# Altium schematic sheet IR Receiver.SchDoc
size A4; SheetNumber: 6; SheetTotal: 7
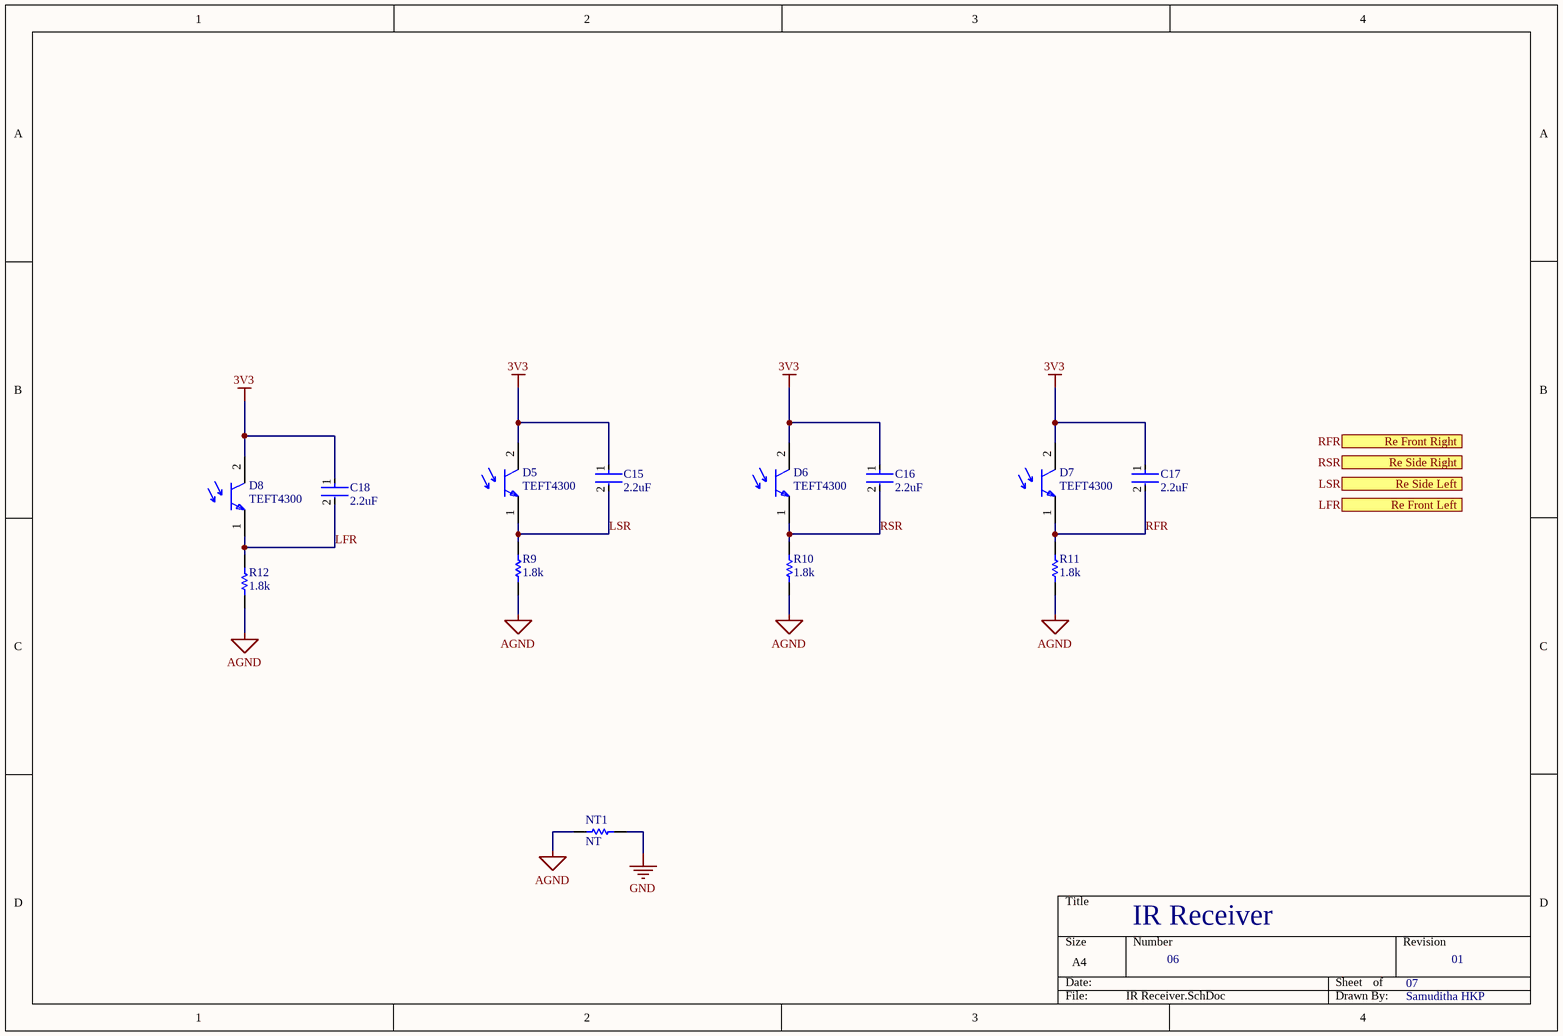
[diagram p0: IR Receiver.SchDoc]

## Parts
C15  2.2uF  [FP-C0402C225M9PACTU-MFG]
C16  2.2uF  [FP-C0402C225M9PACTU-MFG]
C17  2.2uF  [FP-C0402C225M9PACTU-MFG]
C18  2.2uF  [FP-C0402C225M9PACTU-MFG]
D5  TEFT4300  [FP-6_544-5269_01-4-MFG]
D6  TEFT4300  [FP-6_544-5269_01-4-MFG]
D7  TEFT4300  [FP-6_544-5269_01-4-MFG]
D8  TEFT4300  [FP-6_544-5269_01-4-MFG]
NT1  NT  [RESC1005X40X25LL05T05]
R9  1.8k  [RESC1005X40X25LL05T05]
R10  1.8k  [RESC1005X40X25LL05T05]
R11  1.8k  [RESC1005X40X25LL05T05]
R12  1.8k  [RESC1005X40X25LL05T05]

## Ports
Re Front Left (out, see Main[1B], MCU[1B]), Re Front Right (out, see Main[1B], MCU[1B]), Re Side Left (out, see Main[1B], MCU[1B]), Re Side Right (out, see Main[1B], MCU[1B])

## Nets
3V3: C15.1 C16.1 C17.1 C18.1 D5.2(C) D6.2(C) D7.2(C) D8.2(C)
AGND: NT1.2 R9.1 R10.1 R11.1 R12.1
GND: NT1.1
LFR: C18.2 D8.1(E) R12.2 ; port Re Front Left
LSR: C15.2 D5.1(E) R9.2 ; port Re Side Left
RFR: C17.2 D7.1(E) R11.2 ; port Re Front Right
RSR: C16.2 D6.1(E) R10.2 ; port Re Side Right

## Notes on the sheet
- IR Receiver
- 06
- 07
- 01
- Samuditha HKP

## Library data of the parts
C15-C18 = CMP-2008-02064-3: CAP CER 2.2UF 6.3V X5R 0402; Tolerance: 20%; Dissipation Factor: 5%; Dielectric Material: Ceramic; Lead Free: Lead Free; Depth: 0.5mm; Series: C; Termination: SMD/SMT; Case Code (Metric): 1005; Case/Package: 0402; Dielectric: X5R; RoHS Compliant: Yes; Thickness: 0.022inch; Voltage Rating: 6.3V; Voltage: 6.3V; Height: 0.5mm; Mount: Surface Mount; Construction: Flat; Case Code (Imperial): 0402; Min Operating Temperature: -55°C; Contact Plating: Tin; Radiation Hardening: No; Number of Pins: 2; Voltage Rating (DC): 6.3V; Capacitance: 2.2uF; Width: 0.5mm; Package Quantity: 1; Packaging: Tape and Reel; Max Operating Temperature: 85°C; Length: 1mm; REACH SVHC: No SVHC
D5-D8 = CMP-00030-39729854-1: TEFT4300 PHOTOTRANSISTOR 3.0MM WIDE VIEW / Phototransistor IR Chip Silicon 925nm 2-Pin T-1; Polarity: NPN; Lens Style: Domed; Max Power Dissipation: 100mW; Viewing Angle: 30°; Collector Emitter Breakdown Voltage: 70V; Number of Elements: 1; Rise Time: 2µs; Dark Current: 200nA; Collector Emitter Saturation Voltage: 300mV; Fall Time: 2.3µs; Max Collector Current: 50mA; Max Operating Temperature: 100°C; Schedule B: 8541407080, 8541407080; Min Operating Temperature: -40°C; Orientation: Top View; Height: 4.5mm; Radiation Hardening: No; Power Consumption: 100mW; RoHS: Compliant; Case/Package: T; Lead Free: Lead Free; REACH SVHC: Unknown; NexarPartId: 39729854; Mount: Through Hole; Wavelength: 925nm; Power Dissipation: 100mW; Number of Channels: 1; Number of Pins: 2; Collector Emitter Voltage (VCEO): 70V; Width: 3.9mm; Length: 3.2mm
NT1 R9-R12 = CMP-2002-01128-1: Manufacturer: Panasonic; Part Number: ERJ2RKF1801X